# Altium schematic sheet LED_BLOCK.SchDoc
size A4; SheetNumber: 2; SheetTotal: 2
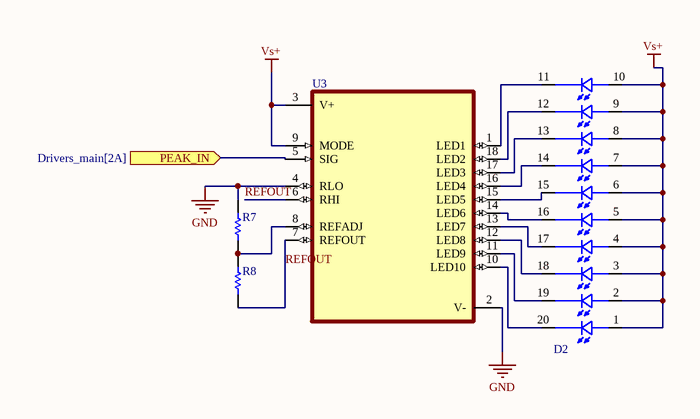
[diagram p0: LED_BLOCK.SchDoc]

## Parts
D2  DC10EWA  [DIP750W50P254L2540H825Q20]  (value not drawn)
R7  MFR-25FBF5210K  [RESA60-630X240]  (value not drawn)
R8  MFR-25FBF5210K  [RESA60-630X240]  (value not drawn)
U3  LM3914N-1  [DIP952W45P254L2336H533Q18]  (value not drawn)

## Ports
PEAK_IN (in, see Drivers_main[2A])

## Nets
GND: R7.2 U3.2(V-) U3.4(RLO)
Vs+: D2.1 D2.2 D2.3 D2.4 D2.5 D2.6 D2.7 D2.8 D2.9 D2.10 U3.3(V+) U3.9(MODE)
PEAK_IN: U3.5(SIG) ; port PEAK_IN
REFOUT: R8.1 U3.6(RHI) U3.7(REFOUT)
NetD2_11: D2.11 U3.1(LED1)
NetD2_12: D2.12 U3.18(LED2)
NetD2_13: D2.13 U3.17(LED3)
NetD2_14: D2.14 U3.16(LED4)
NetD2_15: D2.15 U3.15(LED5)
NetD2_16: D2.16 U3.14(LED6)
NetD2_17: D2.17 U3.13(LED7)
NetD2_18: D2.18 U3.12(LED8)
NetD2_19: D2.19 U3.11(LED9)
NetD2_20: D2.20 U3.10(LED10)
NetR7_1: R7.1 R8.2 U3.8(REFADJ)

## Library data of the parts
D2 = DC10EWA: LED Circuit Board Indicator Bar - 10 Wide, DIP Red (x 10) Diffused, White 2V 30mA Through Hole; MF: Kingbright; Value: *; SnapEDA_Link: https://www.snapeda.com/parts/DC10EWA/Kingbright/view-part/268697/?ref=snap; Purchase-URL: https://pricing.snapeda.com/search/part/DC10EWA/?ref=eda; Availability: In Stock; Price: None; Package: DIP-20 Kingbright; Check_prices: https://www.snapeda.com/parts/DC10EWA/Kingbright/view-part/268697/?ref=eda; MP: DC10EWA
R7 R8 = CMP-1659-00074-2: Axial Resistor, 10 KOhm, +/- 1%, 0.25 W, -55 to 155 degC, 2-Pin THD, RoHS, Bulk; Manufacturer: Yageo; Temperature Coefficient: 100ppm\/degreesC; Voltage Rating: 250V; Voltage Rating (DC): 200V; Resistance: 10KOhm; Max Power Dissipation: 250mW; Datasheet URL: http://www.yageo.com/documents/recent/Yageo%20LR_MFR_2013.pdf; Packaging: Bulk; RoHSCompliant: True; Mount: ThroughHole; Package Reference: MFR-25; Termination: Axial; Composition: MetalFilm; Number of Terminations: 2; Package Quantity: 200; Mounting Technology: ThroughHole; Length: 0.248inch; Max Operating Temperature: 155degC; Min Operating Temperature: -55degC; Datasheet Version: 04/2013; Lead Free: LeadFree; Manufacturer URL: http://www.yageo.com/; Tolerance: 1%; Power Rating: 250mW; Package Description: 2-Pin Axial Lead, Dia 2.4 mm, Body Length 6.3 mm; Military Standard: Not; Case\/Package: Axial
U3 = LM3914N-1: LED, LCD, Vacuum Fluorescent (VF) Driver 18-PDIP; MF: Texas Instruments; SnapEDA_Link: https://www.snapeda.com/parts/LM3914N-1/Texas+Instruments/view-part/?ref=snap; Package: DIP-18 Texas Instruments; Value: *; MP: LM3914N-1; Check_prices: https://www.snapeda.com/parts/LM3914N-1/Texas+Instruments/view-part/?ref=eda